# Altium project Panel-DQLA-Q.PrjPcb
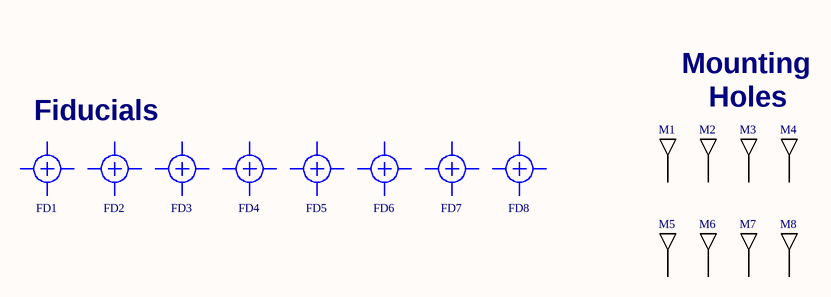
[diagram p0: Panel-DQLA-Q.SchDoc]
1 sheet, 16 parts. Net scope: global (net labels, ports and power ports of the same name join across sheets).
Board file: Panel-DQLA-Q.PcbDoc

## Sheet Panel-DQLA-Q.SchDoc: Panel DQLA-Q
size 381 x 254 mm; Revision: 1.0; SheetNumber: 1; SheetTotal: 1

### Parts
FD1  FD  [FD]  (value not drawn)  (no BOM)
FD2  FD  [FD]  (value not drawn)  (no BOM)
FD3  FD  [FD]  (value not drawn)  (no BOM)
FD4  FD  [FD]  (value not drawn)  (no BOM)
FD5  FD  [FD]  (value not drawn)  (no BOM)
FD6  FD  [FD]  (value not drawn)  (no BOM)
FD7  FD  [FD]  (value not drawn)  (no BOM)
FD8  FD  [FD]  (value not drawn)  (no BOM)
M1  MHOLE  [MHOLE4]  (value not drawn)  (no BOM)
M2  MHOLE  [MHOLE4]  (value not drawn)  (no BOM)
M3  MHOLE  [MHOLE4]  (value not drawn)  (no BOM)
M4  MHOLE  [MHOLE4]  (value not drawn)  (no BOM)
M5  MHOLE  [MHOLE4]  (value not drawn)  (no BOM)
M6  MHOLE  [MHOLE4]  (value not drawn)  (no BOM)
M7  MHOLE  [MHOLE4]  (value not drawn)  (no BOM)
M8  MHOLE  [MHOLE4]  (value not drawn)  (no BOM)

### Nets

Not connected (* = marked no-connect by the designer): M1 1; M2 1; M3 1; M4 1; M5 1; M6 1; M7 1; M8 1

### Notes on the sheet
- To do:
- Mounting
- Fiducials
- Holes
- 1
- 2
- 3
- 4
- 5
- A
- B
- C
- Drawing Title:
- D
- E
- Sheet:
- Rev:
- F
- Title:
- Computational
- Sensing + Robotics
- L A B O R A T O R Y   F O R
- Part No:
- Print Date:
- THE JOHNS HOPKINS UNIVERSITY
- h t t p : / / l c s r . j h u . e d u
- File Name:
- Sheet
- of

### Library data of the parts
M1-M8 = MHOLE: Mounting Hole